# Altium schematic sheet debugger.SchDoc
size Letter; SheetNumber: 4
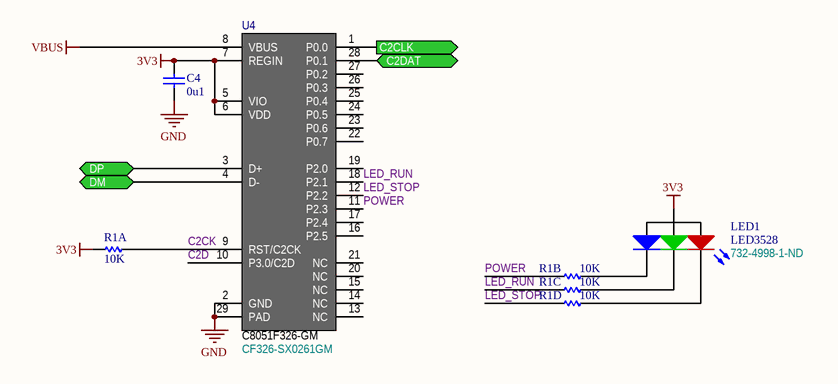
[diagram p0: debugger.SchDoc]

## Parts
C4  0u1  [CAPC1005N]
LED1  LED3528  Supplier Part Number 1: 732-4998-1-ND  [LED3528]
R1  value 10K  [RESNET_8_1206]  (hidden comment: Res Pack5)  (parts A,B,C,D of 4)
U4  C8051F326-GM  Supplier Part Number 1: CF326-SX0261GM  [QFN50P500X500-28VAN]

## Ports
C2CLK (out), C2DAT (bidir), DM (bidir), DP (bidir)

## Nets
3V3: C4.2 LED1.1(A) R1.1 U4.5(VIO) U4.6(VDD) U4.7(REGIN)
GND: C4.1 U4.2(GND) U4.29(PAD)
VBUS: U4.8(VBUS)
C2CK: R1.8 U4.9(RST/C2CK)
C2CLK: U4.1(P0.0) ; port C2CLK
C2D: U4.10(P3.0/C2D)
C2DAT: U4.28(P0.1) ; port C2DAT
DM: U4.4(D-) ; port DM
DP: U4.3(D+) ; port DP
LED_RUN: R1.6 U4.18(P2.1)
LED_STOP: R1.5 U4.12(P2.2)
POWER: R1.7 U4.11(P2.3)
NetLED1_2: LED1.2(K_B) R1.2
NetLED1_3: LED1.3(K_R) R1.4
NetLED1_4: LED1.4(K_G) R1.3

Not connected (* = marked no-connect by the designer): U4 13(NC) 14(NC) 15(NC) 16(P2.5) 17(P2.4) 19(P2.0) 20(NC) 21(NC) 22(P0.7) 23(P0.6) 24(P0.5) 25(P0.4) 26(P0.3) 27(P0.2)

## Library data of the parts
C4 = Cap Semi: Capacitor (Semiconductor SIM Model); Published: 8-Jun-2000; LatestRevisionDate: 29-May-2009; LatestRevisionNote: IPC-7351 Footprint Added.; PackageReference: C1206; Publisher: Altium Limited; PackageDescription: Chip Capacitor
LED1 = LED_RGB: RGB LED; Published: 8-Jun-2000; LatestRevisionDate: 08-Jul-2005; LatestRevisionNote: Mech Layer 1 removed.; PackageReference: LED-0; Publisher: Altium Limited; PackageDescription: LED; 2 Leads; Supplier 1: Digi-Key
R1 = Res Pack5: Isolated Resistor Network - Parts; Sim Note: Enter the Resistance value into parameter field.; Published: 24-Mar-1999; LatestRevisionDate: 29-May-2009; LatestRevisionNote: IPC-7351 Footprint Added.; PackageReference: SOIC16; Publisher: Altium Limited; PackageDescription: 16-Pin Small Outline Integrated Circuit 1.27 mm Pitch; Code_JEDEC: MS-012-AC; Code_IPC: SOIC127P600-16
U4 = C8051F326-GM: IC MCU 8BIT 16KB FLASH 28QFN; Manufacturer: Silicon Labs; Core Processor: 8051; Core Size: 8-Bit; Speed: 25MHz; Connectivity: UART/USART, USB; Peripherals: POR; Number of I/O: 15; Program Memory Size: 16KB (16K x 8); RAM Size: 1.5K x 8; Voltage - Supply (Vcc/Vdd): 2.7 V ~ 3.6 V; Oscillator Type: Internal; Supplier 1: Digi-Key; Manufacturer Part Number: C8051F326-GM; RoHS: RoHS Compliant; Category: Integrated Circuits (ICs); Stock 1: 1461; Pricing 1: 1=1.42, 25=1.3632, 100=1.3108, 1000=1.26561 (USD); Packaging: Tube; Part Status: Active; Program Memory Type: FLASH; EEPROM Size: -; Data Converters: -; Operating Temperature: -40°C ~ 85°C (TA); Package / Case: 28-VFQFN Exposed Pad; Supplier Device Package: 28-QFN (5x5); ComponentLink1URL: http://www.silabs.com/documents/public/data-sheets/C8051F326.pdf; ComponentLink1Description: http://www.silabs.com/documents/public/data-sheets/C8051F326.pdf